# Altium schematic sheet WIFI Module Page.SchDoc: RK3399 COB Design V1.0
size A3; Author: AVIRAL MISHRA; DocumentNumber: 14; SheetNumber: 14; SheetTotal: 27; PROJECT CODE: A_V1.0
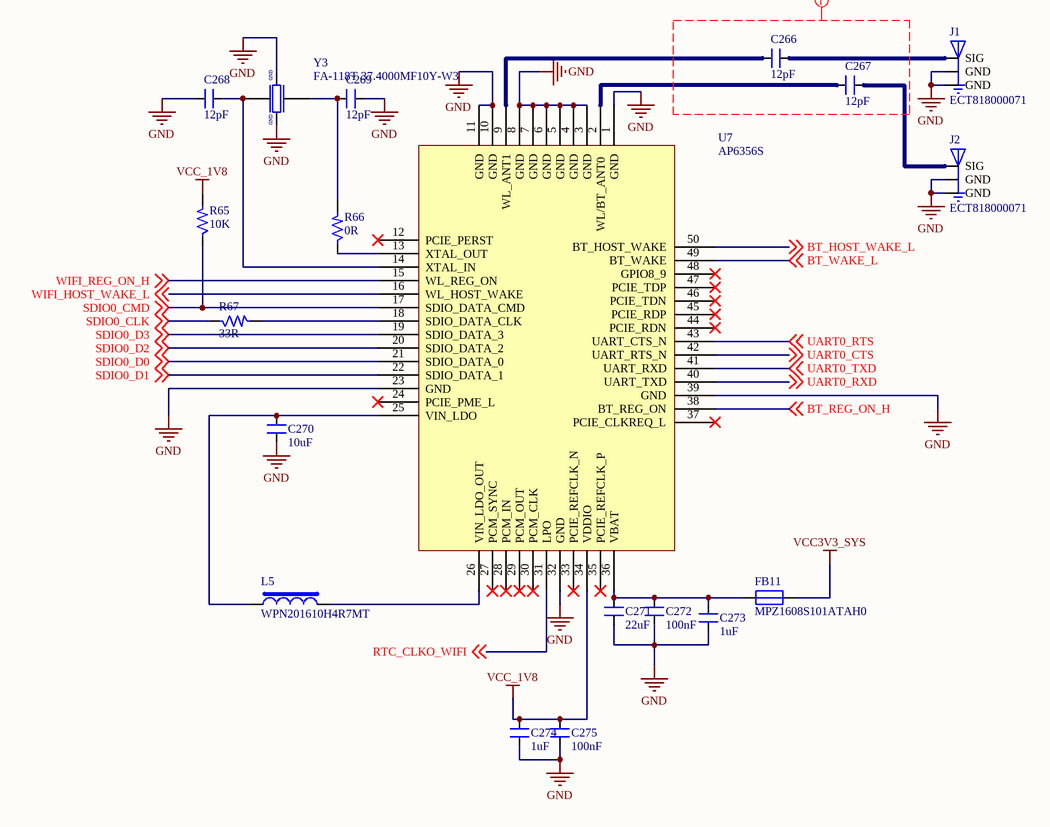
[diagram p0: WIFI Module Page.SchDoc]

## Parts
C266  12pF  [CAP_0603]
C267  12pF  [CAP_0603]
C268  12pF  [CAP_0603]
C269  12pF  [CAP_0603]
C270  10uF  [CAP_0603]
C271  22uF  [CAP_0603]
C272  100nF  [CAP_0805]
C273  1uF  [CAP_0603]
C274  1uF  [CAP_0603]
C275  100nF  [CAP_0805]
FB11  MPZ1608S101ATAH0  [RES_0603]
J1  ECT818000071  [CON3_UFL_116_SMD_ST]
J2  ECT818000071  [CON3_UFL_116_SMD_ST]
L5  WPN201610H4R7MT  [IND_62.9_110X86.6_SMD]
R65  10K  [RES_0603]
R66  0R  [RES_0603]
R67  33R  [RES_0402]
U7  AP6356S  [QFN127P600-8N]
Y3  FA-118T 37.4000MF10Y-W3  [XTAL_FA-118T 37.4000MF10Y-W3]

## Nets
GND: C268.1 C269.2 C270.1 C271.1 C272.1 C273.1 C274.1 C275.1 J1.1(GND) J1.3(GND) J2.1(GND) J2.3(GND) U7.1(GND) U7.3(GND) U7.4(GND) U7.5(GND) U7.6(GND) U7.7(GND) U7.8(GND) U7.10(GND) U7.11(GND) U7.23(GND) U7.32(GND) U7.39(GND) Y3.2 Y3.4
VCC3V3_SYS: FB11.2
VCC_1V8: C274.2 C275.2 R65.2 U7.34(VDDIO)
BT_HOST_WAKE_L: U7.50(BT_HOST_WAKE) ; off-sheet BT_HOST_WAKE_L
BT_REG_ON_H: U7.38(BT_REG_ON) ; off-sheet BT_REG_ON_H
BT_WAKE_L: U7.49(BT_WAKE) ; off-sheet BT_WAKE_L
RTC_CLKO_WIFI: U7.31(LPO) ; off-sheet RTC_CLKO_WIFI
SDIO0_CLK: R67.1 ; off-sheet SDIO0_CLK
SDIO0_CMD: R65.1 U7.17(SDIO_DATA_CMD) ; off-sheet SDIO0_CMD
SDIO0_D0: U7.21(SDIO_DATA_0) ; off-sheet SDIO0_D0
SDIO0_D1: U7.22(SDIO_DATA_1) ; off-sheet SDIO0_D1
SDIO0_D2: U7.20(SDIO_DATA_2) ; off-sheet SDIO0_D2
SDIO0_D3: U7.19(SDIO_DATA_3) ; off-sheet SDIO0_D3
UART0_CTS: U7.42(UART_RTS_N) ; off-sheet UART0_CTS
UART0_RTS: U7.43(UART_CTS_N) ; off-sheet UART0_RTS
UART0_RXD: U7.40(UART_TXD) ; off-sheet UART0_RXD
UART0_TXD: U7.41(UART_RXD) ; off-sheet UART0_TXD
WIFI_HOST_WAKE_L: U7.16(WL_HOST_WAKE) ; off-sheet WIFI_HOST_WAKE_L
WIFI_REG_ON_H: U7.15(WL_REG_ON) ; off-sheet WIFI_REG_ON_H
NetC266_1: C266.1 U7.9(WL_ANT1)
NetC266_2: C266.2 J1.2(SIG)
NetC267_1: C267.1 U7.2(WL/BT_ANT0)
NetC267_2: C267.2 J2.2(SIG)
NetC268_2: C268.2 U7.14(XTAL_IN) Y3.1
NetC269_1: C269.1 R66.2 Y3.3
NetC270_2: C270.2 L5.1 U7.25(VIN_LDO)
NetC271_2: C271.2 C272.2 C273.2 FB11.1 U7.36(VBAT)
NetL5_2: L5.2 U7.26(VIN_LDO_OUT)
NetR66_1: R66.1 U7.13(XTAL_OUT)
NetR67_2: R67.2 U7.18(SDIO_DATA_CLK)

Not connected (* = marked no-connect by the designer): U7 12(PCIE_PERST)* 24(PCIE_PME_L)* 27(PCM_SYNC)* 28(PCM_IN)* 29(PCM_OUT)* 30(PCM_CLK)* 33(PCIE_REFCLK_N)* 35(PCIE_REFCLK_P)* 37(PCIE_CLKREQ_L)* 44(PCIE_RDN)* 45(PCIE_RDP)* 46(PCIE_TDN)* 47(PCIE_TDP)* 48(GPIO8_9)*

## Layout directives
net class 50OHM_ANT: (no net found under the mark)

## Notes on the sheet
- TITLE:
- DOCUMENT NAME:
- SCALE 1:1
- This document is copyright of EsteemPCB and shall not be revealed, produced, copied, in whole or in part, nor
- PROJECT CODE:
- TEMPLATE:
- A4
- AUTHOR:
- Sheet
- of
- used for any purpose other than submitted.
- (in symbol XTAL_37.4 MHz-12pF-SMD) GND

## Library data of the parts
C266-C269 = CAP_12pF-10V-10%-0603: 12pF ±10% 10V Ceramic Capacitor X8R 0603 (1608 Metric) /; Manufacturer: KEMET; Manufacturer Part Number: C0603X120K8HAC7867; Case/Package: 0603; Supplier-1: Digikey
C270 = CAP_10uF-10V-10%-0603: 10µF ±10% 10V Ceramic Capacitor X5R 0603 (1608 Metric) /; Manufacturer Part Number: GRM188R61A106KE69J; Manufacturer: Murata Electronics; Case/Package: 0603; Supplier-1: Digikey
C271 = CAP_22uF-10V-20%-0603: 22µF ±20% 10V Ceramic Capacitor X5R 0603 (1608 Metric) /; Manufacturer: Murata Electronics; Manufacturer Part Number: GRM188R61A226ME15D; Case/Package: 0603; Supplier-1: Digikey
C272 C275 = CAP_100nF-25V-10%-0805: 0.1µF ±10% 25V Ceramic Capacitor X7R 0805 (2012 Metric) /; Manufacturer: Yageo; Manufacturer Part Number: CC0805KRX7R8BB104; Case/Package: 0805; Supplier-1: Digikey
C273 C274 = CAP_1uF-16V-10%-0603: 1µF ±10% 16V Ceramic Capacitor X7R 0603 (1608 Metric) /; Manufacturer: Yageo; Manufacturer Part Number: CC0603KRX7R7BB105; Case/Package: 0603; Supplier-1: Digikey
FB11 = FB_100R-3A-100Mhz-0603: Ferrite Beads 100ohms 3A 30mOhms 0603 Ferrite Chip; Manufacturer: TDK; Mnaufacturer Part Number: MPZ1608S101ATAH0; Case/Package: 0603; Supplier-1: Digikey
J1 J2 = CON-PLG_3X1-ECT818000071-ST-SMD: SMD RF Connectors/Coaxial Connectors RoHS; Manufacturer: ECT; Manufacturer Part Number: ECT818000071; Case/Package: SMD; Supplier-1: LCSC
L5 = IND_4.7uH-0.9A-20%-SMD: 4.7uH ±20% 900mA 425mΩ SMD,2.0x1.6x1.0mm Power Inductors RoHS /; Manufacturer: Sunlord; Manufacturer Part Number: WPN201610H4R7MT; Case/Package: SMD; Supplier-1: LCSC
R65 = RES_10K-0.1W-1%-0603: 10 kOhms ±1% 0.1W, 1/10W Chip Resistor 0603 (1608 Metric) Thick Film /; Manufacturer: Yageo; Manufacturer Part Number: RC0603FR-0710KL; Case/Package: 0603; Supplier-1: Digikey
R66 = RES_0R-0.1W-1%-0603: 0 Ohms Jumper 0.1W, 1/10W Chip Resistor 0603 (1608 Metric) Thick Film; Manufacturer: Yageo; Manufacturer Part Number: RC0603JR-070RL; Case/Package: 0603; Supplier-1: Digikey
R67 = RES_33R-0.1W-1%-0402: 33 Ohms ±1% 0.1W, 1/10W Chip Resistor 0402 (1005 Metric) Automotive AEC-Q200 Thick Film /; Manufacturer: Panasonic Electronic Components; Manufacturer Part Number: ERJ-2RKF33R0X; Case/Package: 0402; Supplier-1: Digikey
U7 = IC_AP6356S: AMPAK Technology would like to announce a low-cost and low-power consumption module / which has all of the WiFi and Bluetooth functionalities.; Manufacturer: Rockchip; Manufacturer Part Number: AP6356S; Case/Package: NA; Supplier-1: Rockchip
Y3 = XTAL_37.4 MHz-12pF-SMD: Crystals 37.4MHz 10ppm 12pF -30C +85C; Manufacturer: Epson Timing; Manufacturer Part Number: FA-118T 37.4000MF10Y-W3; Case/Package: SMD; Supplier-1: Mouser